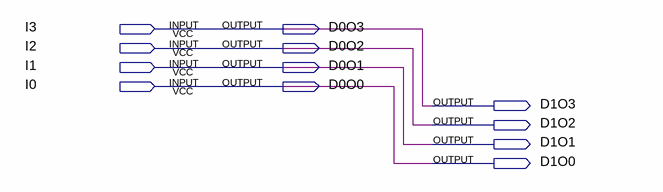
[diagram p0: schematic sheet]
// Quartus schematic 4InputDuplicator.bdf as structural Verilog: 0 symbols, 12 pins
module \4InputDuplicator  (
  input  I3,
  input  I2,
  input  I1,
  input  I0,
  output D0O3,
  output D0O2,
  output D0O1,
  output D0O0,
  output D1O3,
  output D1O2,
  output D1O1,
  output D1O0
);


  assign D0O0 = I0;
  assign D0O1 = I1;
  assign D0O2 = I2;
  assign D0O3 = I3;
  assign D1O0 = I0;
  assign D1O1 = I1;
  assign D1O2 = I2;
  assign D1O3 = I3;
endmodule
